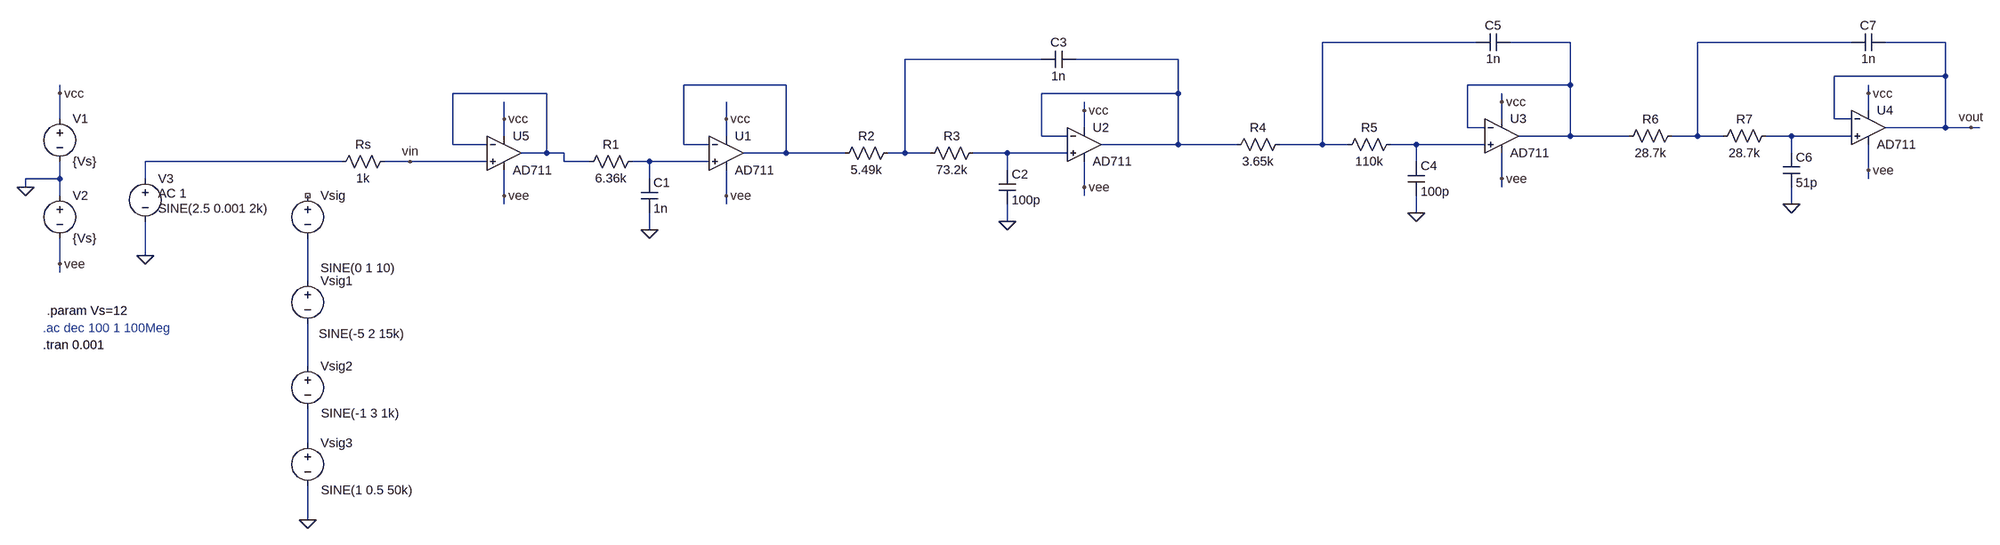
[diagram p0: schematic AA filter 20kHz 7th order.asc]
AA filter 20kHz 7th order.asc, the LTspice schematic file:
Version 4
SHEET 1 3192 756
WIRE 2048 -160 1760 -160
WIRE 2224 -160 2112 -160
WIRE 2784 -160 2496 -160
WIRE 2960 -160 2848 -160
WIRE 1216 -128 960 -128
WIRE 1472 -128 1280 -128
WIRE 2960 -96 2960 -160
WIRE 2960 -96 2752 -96
WIRE 656 -80 464 -80
WIRE 2224 -80 2224 -160
WIRE 2224 -80 2032 -80
WIRE -704 -64 -704 -80
WIRE 208 -64 32 -64
WIRE 1472 -64 1472 -128
WIRE 1472 -64 1216 -64
WIRE 2816 -64 2816 -80
WIRE 2096 -48 2096 -64
WIRE 1296 -32 1296 -48
WIRE 2816 -32 2816 -64
WIRE -704 -16 -704 -64
WIRE 128 -16 128 -48
WIRE 544 -16 544 -48
WIRE 2096 -16 2096 -48
WIRE 2752 -16 2752 -96
WIRE 2784 -16 2752 -16
WIRE 1296 0 1296 -32
WIRE 2032 0 2032 -80
WIRE 2064 0 2032 0
WIRE 2960 0 2960 -96
WIRE 2960 0 2848 0
WIRE 3008 0 2960 0
WIRE 3024 0 3008 0
WIRE 128 16 128 -16
WIRE 544 16 544 -16
WIRE 1216 16 1216 -64
WIRE 1264 16 1216 16
WIRE 2224 16 2224 -80
WIRE 2224 16 2128 16
WIRE 2368 16 2224 16
WIRE 2496 16 2496 -160
WIRE 2496 16 2448 16
WIRE 2544 16 2496 16
WIRE 2672 16 2624 16
WIRE 2784 16 2672 16
WIRE 32 32 32 -64
WIRE 96 32 32 32
WIRE 464 32 464 -80
WIRE 512 32 464 32
WIRE 1472 32 1472 -64
WIRE 1472 32 1328 32
WIRE 1600 32 1472 32
WIRE 1760 32 1760 -160
WIRE 1760 32 1680 32
WIRE 1808 32 1760 32
WIRE 1936 32 1888 32
WIRE 2064 32 1936 32
WIRE 208 48 208 -64
WIRE 208 48 160 48
WIRE 240 48 208 48
WIRE 656 48 656 -80
WIRE 656 48 576 48
WIRE 848 48 656 48
WIRE 960 48 960 -128
WIRE 960 48 928 48
WIRE 1008 48 960 48
WIRE 1152 48 1088 48
WIRE 1264 48 1152 48
WIRE 2672 48 2672 16
WIRE -176 64 -544 64
WIRE -48 64 -96 64
WIRE 96 64 -48 64
WIRE 240 64 240 48
WIRE 288 64 240 64
WIRE 400 64 368 64
WIRE 512 64 400 64
WIRE 1936 64 1936 32
WIRE 1152 80 1152 48
WIRE 2816 80 2816 32
WIRE -704 96 -704 64
WIRE -704 96 -768 96
WIRE -544 96 -544 64
WIRE 400 96 400 64
WIRE 2096 96 2096 48
WIRE 2816 96 2816 80
WIRE -768 112 -768 96
WIRE 1296 112 1296 64
WIRE 2096 112 2096 96
WIRE -704 128 -704 96
WIRE 128 128 128 80
WIRE 544 128 544 80
WIRE 1296 128 1296 112
WIRE 128 144 128 128
WIRE 544 144 544 128
WIRE 2672 144 2672 112
WIRE 1936 160 1936 128
WIRE 1152 176 1152 144
WIRE 400 192 400 160
WIRE -544 240 -544 176
WIRE -704 256 -704 208
WIRE -704 272 -704 256
WIRE -240 288 -240 208
WIRE -240 448 -240 368
WIRE -240 592 -240 528
WIRE -240 736 -240 672
FLAG -768 112 0
FLAG -704 256 vee
FLAG -704 -64 vcc
FLAG 544 -16 vcc
FLAG 544 128 vee
FLAG 400 192 0
FLAG 1152 176 0
FLAG 1296 -32 vcc
FLAG 1296 112 vee
FLAG 1936 160 0
FLAG 2096 -48 vcc
FLAG 2096 96 vee
FLAG 2672 144 0
FLAG 2816 -64 vcc
FLAG 2816 80 vee
FLAG 3008 0 vout
FLAG -48 64 vin
FLAG -240 736 0
FLAG -544 240 0
FLAG 128 -16 vcc
FLAG 128 128 vee
SYMBOL voltage -240 112 R0
WINDOW 3 24 152 Left 2
WINDOW 123 24 124 Left 2
WINDOW 39 0 0 Left 0
SYMATTR Value SINE(0 1 10)
SYMATTR InstName Vsig
SYMBOL res -80 48 R90
WINDOW 0 0 56 VBottom 2
WINDOW 3 32 56 VTop 2
SYMATTR InstName Rs
SYMATTR Value 1k
SYMBOL OpAmps\\AD711 544 -16 R0
SYMATTR InstName U1
SYMBOL voltage -704 -32 R0
WINDOW 123 0 0 Left 0
WINDOW 39 0 0 Left 0
SYMATTR InstName V1
SYMATTR Value {Vs}
SYMBOL voltage -704 112 R0
WINDOW 123 0 0 Left 0
WINDOW 39 0 0 Left 0
SYMATTR InstName V2
SYMATTR Value {Vs}
SYMBOL res 384 48 R90
WINDOW 0 0 56 VBottom 2
WINDOW 3 32 56 VTop 2
SYMATTR InstName R1
SYMATTR Value 6.36k
SYMBOL cap 384 96 R0
SYMATTR InstName C1
SYMATTR Value 1n
SYMBOL res 944 32 R90
WINDOW 0 0 56 VBottom 2
WINDOW 3 32 56 VTop 2
SYMATTR InstName R2
SYMATTR Value 5.49k
SYMBOL res 1104 32 R90
WINDOW 0 0 56 VBottom 2
WINDOW 3 32 56 VTop 2
SYMATTR InstName R3
SYMATTR Value 73.2k
SYMBOL cap 1136 80 R0
SYMATTR InstName C2
SYMATTR Value 100p
SYMBOL cap 1280 -144 R90
WINDOW 0 0 32 VBottom 2
WINDOW 3 32 32 VTop 2
SYMATTR InstName C3
SYMATTR Value 1n
SYMBOL OpAmps\\AD711 1296 -32 R0
SYMATTR InstName U2
SYMBOL res 1696 16 R90
WINDOW 0 0 56 VBottom 2
WINDOW 3 32 56 VTop 2
SYMATTR InstName R4
SYMATTR Value 3.65k
SYMBOL res 1904 16 R90
WINDOW 0 0 56 VBottom 2
WINDOW 3 32 56 VTop 2
SYMATTR InstName R5
SYMATTR Value 110k
SYMBOL cap 1920 64 R0
SYMATTR InstName C4
SYMATTR Value 100p
SYMBOL cap 2112 -176 R90
WINDOW 0 0 32 VBottom 2
WINDOW 3 32 32 VTop 2
SYMATTR InstName C5
SYMATTR Value 1n
SYMBOL OpAmps\\AD711 2096 -48 R0
SYMATTR InstName U3
SYMBOL res 2464 0 R90
WINDOW 0 0 56 VBottom 2
WINDOW 3 32 56 VTop 2
SYMATTR InstName R6
SYMATTR Value 28.7k
SYMBOL res 2640 0 R90
WINDOW 0 0 56 VBottom 2
WINDOW 3 32 56 VTop 2
SYMATTR InstName R7
SYMATTR Value 28.7k
SYMBOL cap 2656 48 R0
SYMATTR InstName C6
SYMATTR Value 51p
SYMBOL cap 2848 -176 R90
WINDOW 0 0 32 VBottom 2
WINDOW 3 32 32 VTop 2
SYMATTR InstName C7
SYMATTR Value 1n
SYMBOL OpAmps\\AD711 2816 -64 R0
SYMATTR InstName U4
SYMBOL voltage -240 272 R0
WINDOW 3 21 115 Left 2
WINDOW 123 24 124 Left 2
WINDOW 39 0 0 Left 0
SYMATTR Value SINE(-5 2 15k)
SYMATTR InstName Vsig1
SYMBOL voltage -240 432 R0
WINDOW 3 25 104 Left 2
WINDOW 123 24 124 Left 2
WINDOW 39 0 0 Left 0
SYMATTR Value SINE(-1 3 1k)
SYMATTR InstName Vsig2
SYMBOL voltage -240 576 R0
WINDOW 3 25 104 Left 2
WINDOW 123 24 124 Left 2
WINDOW 39 0 0 Left 0
SYMATTR Value SINE(1 0.5 50k)
SYMATTR InstName Vsig3
SYMBOL voltage -544 80 R0
WINDOW 123 24 44 Left 2
WINDOW 39 0 0 Left 0
WINDOW 3 24 72 Left 2
SYMATTR Value2 AC 1
SYMATTR InstName V3
SYMATTR Value SINE(2.5 0.001 2k)
SYMBOL OpAmps\\AD711 128 -16 R0
SYMATTR InstName U5
TEXT -728 344 Left 2 !.param Vs=12
TEXT -736 376 Left 2 ;.ac dec 100 1 100Meg
TEXT -736 408 Left 2 !.tran 0.001

The netlist it stands for:
* AA filter 20kHz 7th order.asc
Vsig NC_01 N013 SINE(0 1 10)
Rs vin N011 1k
XU1 N012 N006 vcc vee N006 AD712  ; AD711, pins In+ In- V+ V- OUT
V1 vcc 0 {Vs}
V2 0 vee {Vs}
R1 N012 N007 6.36k
C1 N012 0 1n
R2 N004 N006 5.49k
R3 N010 N004 73.2k
C2 N010 0 100p
C3 N005 N004 1n
XU2 N010 N005 vcc vee N005 AD712  ; AD711, pins In+ In- V+ V- OUT
R4 N001 N005 3.65k
R5 N009 N001 110k
C4 N009 0 100p
C5 N002 N001 1n
XU3 N009 N002 vcc vee N002 AD712  ; AD711, pins In+ In- V+ V- OUT
R6 N003 N002 28.7k
R7 N008 N003 28.7k
C6 N008 0 51p
C7 vout N003 1n
XU4 N008 vout vcc vee vout AD712  ; AD711, pins In+ In- V+ V- OUT
Vsig1 N013 N014 SINE(-5 2 15k)
Vsig2 N014 N015 SINE(-1 3 1k)
Vsig3 N015 0 SINE(1 0.5 50k)
V3 N011 0 SINE(2.5 0.001 2k) AC 1
XU5 vin N007 vcc vee N007 AD712  ; AD711, pins In+ In- V+ V- OUT
.param Vs=12
* .ac dec 100 1 100Meg
.tran 0.001
.lib ADI1.lib
.backanno
.end